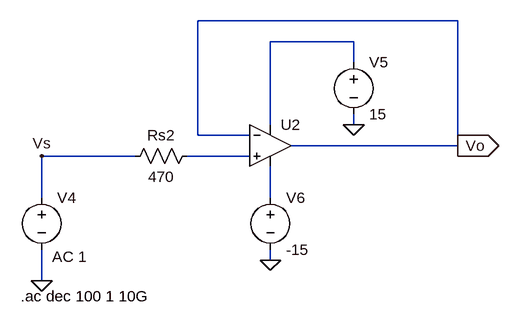
[diagram p0: schematic Run_3_B.asc]
Run_3_B.asc, the LTspice schematic file:
Version 4
SHEET 1 880 680
WIRE -96 -64 -496 -64
WIRE -256 -32 -384 -32
WIRE -256 0 -256 -32
WIRE -384 96 -384 -32
WIRE -256 96 -256 80
WIRE -496 112 -496 -64
WIRE -416 112 -496 112
WIRE -96 128 -96 -64
WIRE -96 128 -352 128
WIRE -592 144 -736 144
WIRE -416 144 -512 144
WIRE -736 208 -736 144
WIRE -384 208 -384 160
WIRE -384 304 -384 288
WIRE -736 336 -736 288
FLAG -736 336 0
FLAG -96 128 Vo
IOPIN -96 128 Out
FLAG -736 144 Vs
FLAG -256 96 0
FLAG -384 304 0
SYMBOL OpAmps\\UniversalOpamp2 -384 128 R0
SYMATTR InstName U2
SYMBOL res -496 128 R90
WINDOW 0 0 56 VBottom 2
WINDOW 3 32 56 VTop 2
SYMATTR InstName Rs2
SYMATTR Value 470
SYMBOL voltage -736 192 R0
WINDOW 3 24 152 Left 2
WINDOW 123 16 107 Left 2
WINDOW 39 0 0 Left 0
SYMATTR Value ""
SYMATTR Value2 AC 1
SYMATTR InstName V4
SYMBOL voltage -256 -16 R0
WINDOW 123 0 0 Left 0
WINDOW 39 0 0 Left 0
SYMATTR InstName V5
SYMATTR Value 15
SYMBOL voltage -384 192 R0
WINDOW 123 0 0 Left 0
WINDOW 39 0 0 Left 0
SYMATTR InstName V6
SYMATTR Value -15
TEXT -768 360 Left 2 !.ac dec 100 1 10G

The netlist it stands for:
* Run_3_B.asc
XU2 N002 Vo N001 N003 Vo level.2 Avol=1Meg GBW=10Meg Slew=10Meg ilimit=25m rail=0 Vos=0 phimargin=45 en=0 enk=0 in=0 ink=0 Rin=500Meg  ; pins IN+ IN- V+ V- OUT
Rs2 N002 Vs 470
V4 Vs 0 AC 1
V5 N001 0 15
V6 N003 0 -15
.ac dec 100 1 10G
.lib UniversalOpamps2.sub
.backanno
.end